# EAGLE design Driver Board (EAGLE 9.6.2)
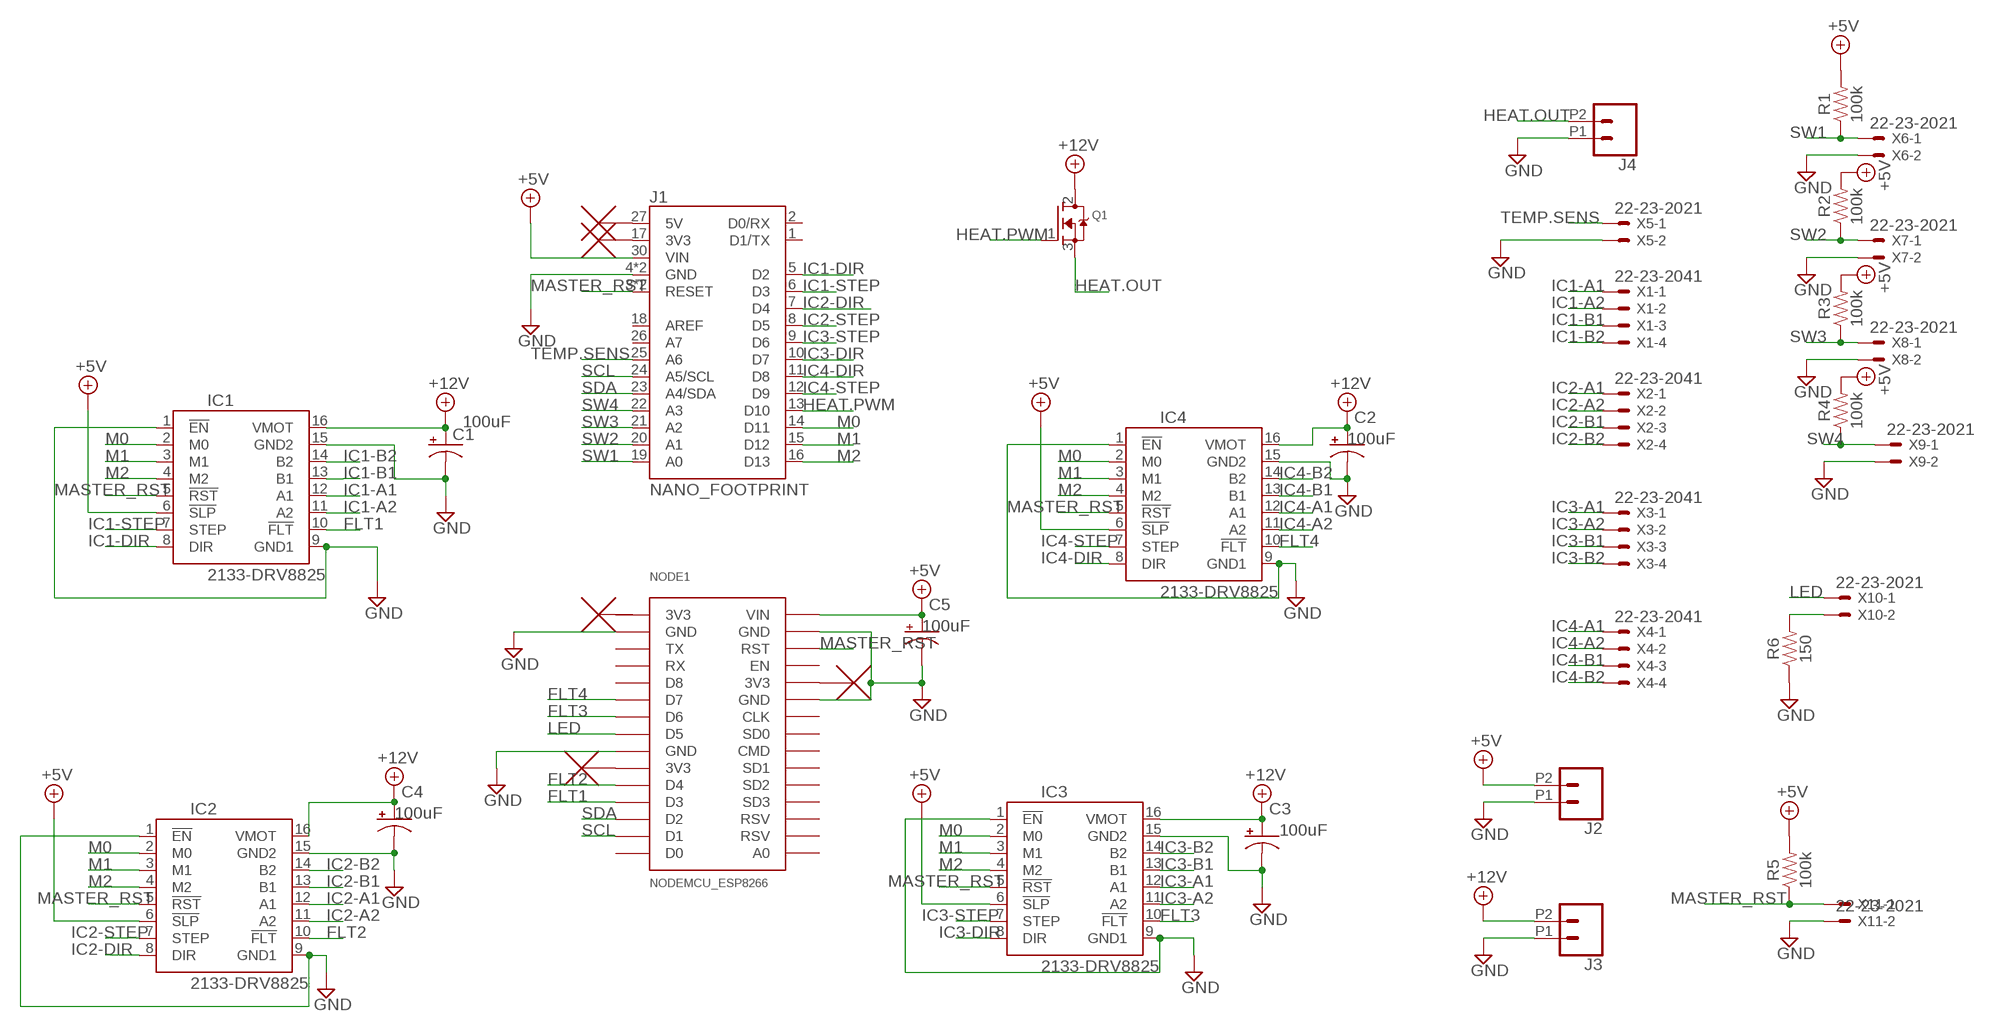
[diagram p0: schematic, sheet 1]

## Parts
C1  CPOL-USD  [PANASONIC_D]
C2  CPOL-USD  [PANASONIC_D]
C3  CPOL-USD  [PANASONIC_D]
C4  CPOL-USD  [PANASONIC_D]
C5  CPOL-USD  [PANASONIC_D]
IC1  2133-DRV8825  [DRV8825]
IC2  2133-DRV8825  [DRV8825]
IC3  2133-DRV8825  [DRV8825]
IC4  2133-DRV8825  [DRV8825]
J1  NANO_FOOTPRINT  [NANO]
J2  CONN_02SCREWTERMINAL-6.35MM-2  [1X02_6.35_SCREWTERM]
J3  CONN_02SCREWTERMINAL-6.35MM-2  [1X02_6.35_SCREWTERM]
J4  CONN_02SCREWTERMINAL-6.35MM-2  [1X02_6.35_SCREWTERM]
NODE1  NODEMCU_ESP8266  [NODEMCU_ESP8266]
Q1  MOSFET-NGDS_TO220V  [TO220V]
R1  100k  0.22OHM-0805-1/4W-1%  [0805]
R2  100k  0.22OHM-0805-1/4W-1%  [0805]
R3  100k  0.22OHM-0805-1/4W-1%  [0805]
R4  100k  0.22OHM-0805-1/4W-1%  [0805]
R5  100k  0.22OHM-0805-1/4W-1%  [0805]
R6  150  0.22OHM-0805-1/4W-1%  [0805]
U$1  NC_MARKER  (no package)
U$2  NC_MARKER  (no package)
U$3  NC_MARKER  (no package)
U$4  NC_MARKER  (no package)
U$5  NC_MARKER  (no package)
X1  22-23-2041  [22-23-2041]
X2  22-23-2041  [22-23-2041]
X3  22-23-2041  [22-23-2041]
X4  22-23-2041  [22-23-2041]
X5  22-23-2021  [22-23-2021]
X6  22-23-2021  [22-23-2021]
X7  22-23-2021  [22-23-2021]
X8  22-23-2021  [22-23-2021]
X9  22-23-2021  [22-23-2021]
X10  22-23-2021  [22-23-2021]
X11  22-23-2021  [22-23-2021]

## Nets
+5V: C5.+ IC1.6(!SLP) IC2.6(!SLP) IC3.6(!SLP) IC4.6(!SLP) J1.30(VIN) J2.P2 NODE1.VIN R1.2 R2.2 R3.2 R4.2 R5.2
+12V: C1.+ C2.+ C3.+ C4.+ IC1.16(VMOT) IC2.16(VMOT) IC3.16(VMOT) IC4.16(VMOT) J3.P2 Q1.2(D)
FLT1: IC1.10(!FLT) NODE1.D3
FLT2: IC2.10(!FLT) NODE1.D4
FLT3: IC3.10(!FLT) NODE1.D6
FLT4: IC4.10(!FLT) NODE1.D7
GND: C1.- C2.- C3.- C4.- C5.- IC1.1(!EN) IC1.9(GND1) IC1.15(GND2) IC2.1(!EN) IC2.9(GND1) IC2.15(GND2) IC3.1(!EN) IC3.9(GND1) IC3.15(GND2) IC4.1(!EN) IC4.9(GND1) IC4.15(GND2) J1.4(GND) J1.29(GND) J2.P1 J3.P1 J4.P1 NODE1.GND@1(GND) NODE1.GND@2(GND) NODE1.GND@3(GND) NODE1.GND@4(GND) R6.1 X5.2 X6.2 X7.2 X8.2 X9.2 X11.2
HEAT.OUT: J4.P2 Q1.3(S)
HEAT.PWM: J1.13(D10) Q1.1(G)
IC1-A1: IC1.12(A1) X1.1
IC1-A2: IC1.11(A2) X1.2
IC1-B1: IC1.13(B1) X1.3
IC1-B2: IC1.14(B2) X1.4
IC1-DIR: IC1.8(DIR) J1.5(D2)
IC1-STEP: IC1.7(STEP) J1.6(D3)
IC2-A1: IC2.12(A1) X2.1
IC2-A2: IC2.11(A2) X2.2
IC2-B1: IC2.13(B1) X2.3
IC2-B2: IC2.14(B2) X2.4
IC2-DIR: IC2.8(DIR) J1.7(D4)
IC2-STEP: IC2.7(STEP) J1.8(D5)
IC3-A1: IC3.12(A1) X3.1
IC3-A2: IC3.11(A2) X3.2
IC3-B1: IC3.13(B1) X3.3
IC3-B2: IC3.14(B2) X3.4
IC3-DIR: IC3.8(DIR) J1.10(D7)
IC3-STEP: IC3.7(STEP) J1.9(D6)
IC4-A1: IC4.12(A1) X4.1
IC4-A2: IC4.11(A2) X4.2
IC4-B1: IC4.13(B1) X4.3
IC4-B2: IC4.14(B2) X4.4
IC4-DIR: IC4.8(DIR) J1.11(D8)
IC4-STEP: IC4.7(STEP) J1.12(D9)
LED: NODE1.D5 X10.1
M0: IC1.2(M0) IC2.2(M0) IC3.2(M0) IC4.2(M0) J1.14(D11)
M1: IC1.3(M1) IC2.3(M1) IC3.3(M1) IC4.3(M1) J1.15(D12)
M2: IC1.4(M2) IC2.4(M2) IC3.4(M2) IC4.4(M2) J1.16(D13)
MASTER_RST: IC1.5(!RST) IC2.5(!RST) IC3.5(!RST) IC4.5(!RST) J1.3(RESET) J1.28(RESET) NODE1.RST R5.1 X11.1
N$1: NODE1.3V3@2(3V3) U$2.P$1
N$2: NODE1.3V3@3(3V3) U$3.P$1
N$3: J1.27(5V) U$4.P$1
N$4: J1.17(3V3) U$5.P$1
N$9: R6.2 X10.2
SCL: J1.24(A5/SCL) NODE1.D1
SDA: J1.23(A4/SDA) NODE1.D2
SW1: J1.19(A0) R1.1 X6.1
SW2: J1.20(A1) R2.1 X7.1
SW3: J1.21(A2) R3.1 X8.1
SW4: J1.22(A3) R4.1 X9.1
TEMP.SENS: J1.25(A6) X5.1
Unconnected: J1.1(D1/TX) J1.2(D0/RX) J1.18(AREF) J1.26(A7) NODE1.A0 NODE1.CLK NODE1.CMD NODE1.D0 NODE1.D8 NODE1.EN NODE1.RSV1(RSV) NODE1.RSV2(RSV) NODE1.RX NODE1.SD1 NODE1.SD2 NODE1.SD3 NODE1.SDO(SD0) NODE1.TX U$1.P$1

## Power pins joined to a net without a drawn wire
3V3: NODE1.3V3@1(3V3)

## Library data of the parts
C1-C5 = adafruit:CPOL-US: POLARIZED CAPACITOR, American symbol; C: 100uF
IC1-IC4 = pololu-stepper-driver:2133-DRV8825: DRV8825 Stepper Motor Driver Carrier, High Current #2133 DRV8825 Stepper Motor Driver Carrier; High Current <https://www.pololu.com/product/2133> in Japan, Suzaku Lab. Ltd. <https://suzakugiken.jp/> #2133 DRV8825 大電流用ステッピングモータドライバ <https://szc.jp/po2133>
J1 = SparkFun-Boards:NANO_FOOTPRINT: Generic Nano Footprint
J2-J4 = SparkFun-Connectors:CONN_02: Multi connection point. Often used as Generic Header-pin footprint for 0.1 inch spaced/style header connections On any of the 0.1 inch spaced packages, you can populate with these: Break Away Headers - Straight <https://www.sparkfun.com/products/116> (PRT-00116) Break Away Male Headers - Right Angle <https://www.sparkfun.com/products/553> (PRT-00553) Female Headers <https://www.sparkfun.com/products/115> (PRT-00115) Break Away Headers - Machine Pin <https://www.sparkfun.com/products/117> (PRT-00117) Break Away Female Headers - Swiss Machine Pin <https://www.sparkfun.com/products/743> (PRT-00743) For SCREWTERMINALS and SPRING TERMINALS visit here: Screw Terimnals on SparkFun.com <https://www.sparkfun.com/search/results?term=Screw+Terminals> (5mm/3.5mm/2.54mm spacing) This device is also useful as a general connection point to wire up your design to another part of your project. Our various solder wires solder well into these plated through hole pads. Hook-Up Wire - Assortment (Stranded, 22 AWG) <https://www.sparkfun.com/products/11375> (PRT-11375) Hook-Up Wire - Assortment (Solid Core, 22 AWG) <https://www.sparkfun.com/products/11367> (PRT-11367) View the entire wire category on our website here <https://www.sparkfun.com/categories/141> Special notes: Molex polarized connector foot print use with: PRT-08233 with associated crimp pins and housings. 2.54_SCREWTERM for use with PRT-10571. 3.5mm Screw Terminal footprints for PRT-08084 5mm Screw Terminal footprints for use with PRT-08432; PROD_ID: CONN-15154
NODE1 = nodemcu_esp8266:NODEMCU_ESP8266: Node MCU V2 (ESP8266) Created by Harish
Q1 = adafruit:MOSFET-N: N-Channel Mosfet 2N7002E - 60V 260mA SOT23 [Digikey: 2N7002ET1GOSTR-ND] - REEL BSH103 - 30V 850mA SOT23 [Digikey: 568-5013-1-ND]
R1-R6 = SparkFun-Resistors:0.22OHM: 0.22Ω resistor A resistor is a passive two-terminal electrical component that implements electrical resistance as a circuit element. Resistors act to reduce current flow, and, at the same time, act to lower voltage levels within circuits. - Wikipedia; PROD_ID: RES-09883; VALUE: 0.22
U$1-U$5 = NC_MARKER:NC_MARKER
X1-X4 = con-molex:22-23-2041: .100" (2.54mm) Center Header - 4 Pin; MF: MOLEX; MPN: 22-23-2041; OC_FARNELL: 1462920; OC_NEWARK: 38C0355
X5-X11 = con-molex:22-23-2021: .100" (2.54mm) Center Header - 2 Pin; MF: MOLEX; MPN: 22-23-2021; OC_FARNELL: 1462926; OC_NEWARK: 25C3832

## Board
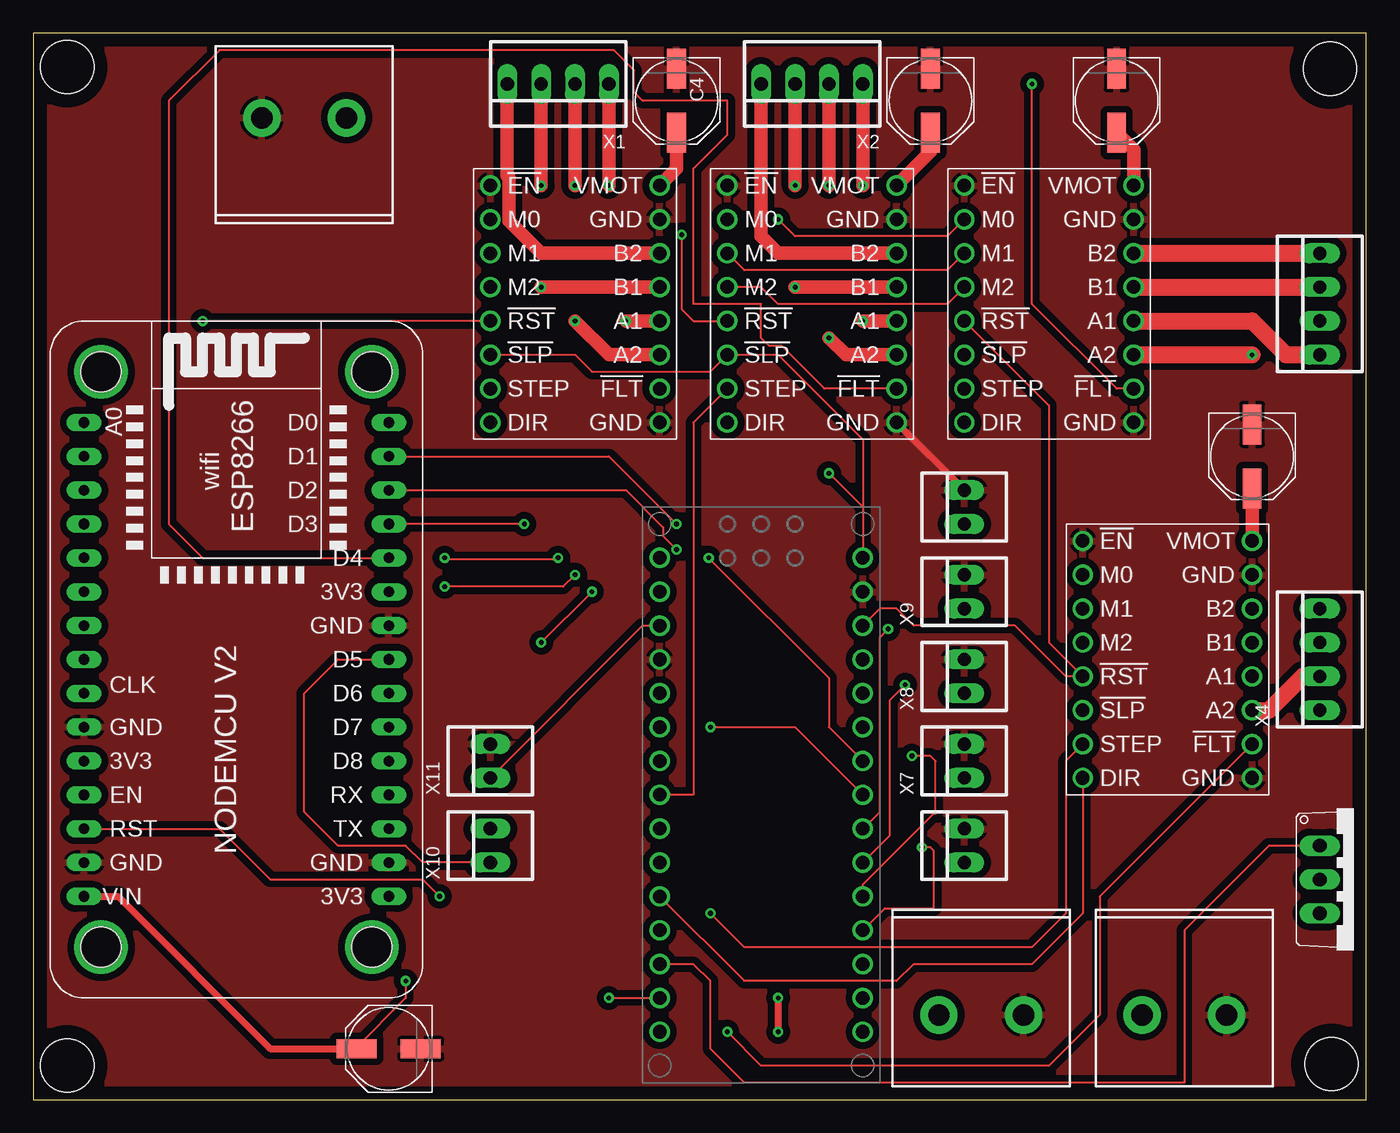
[diagram p1: board, top side]
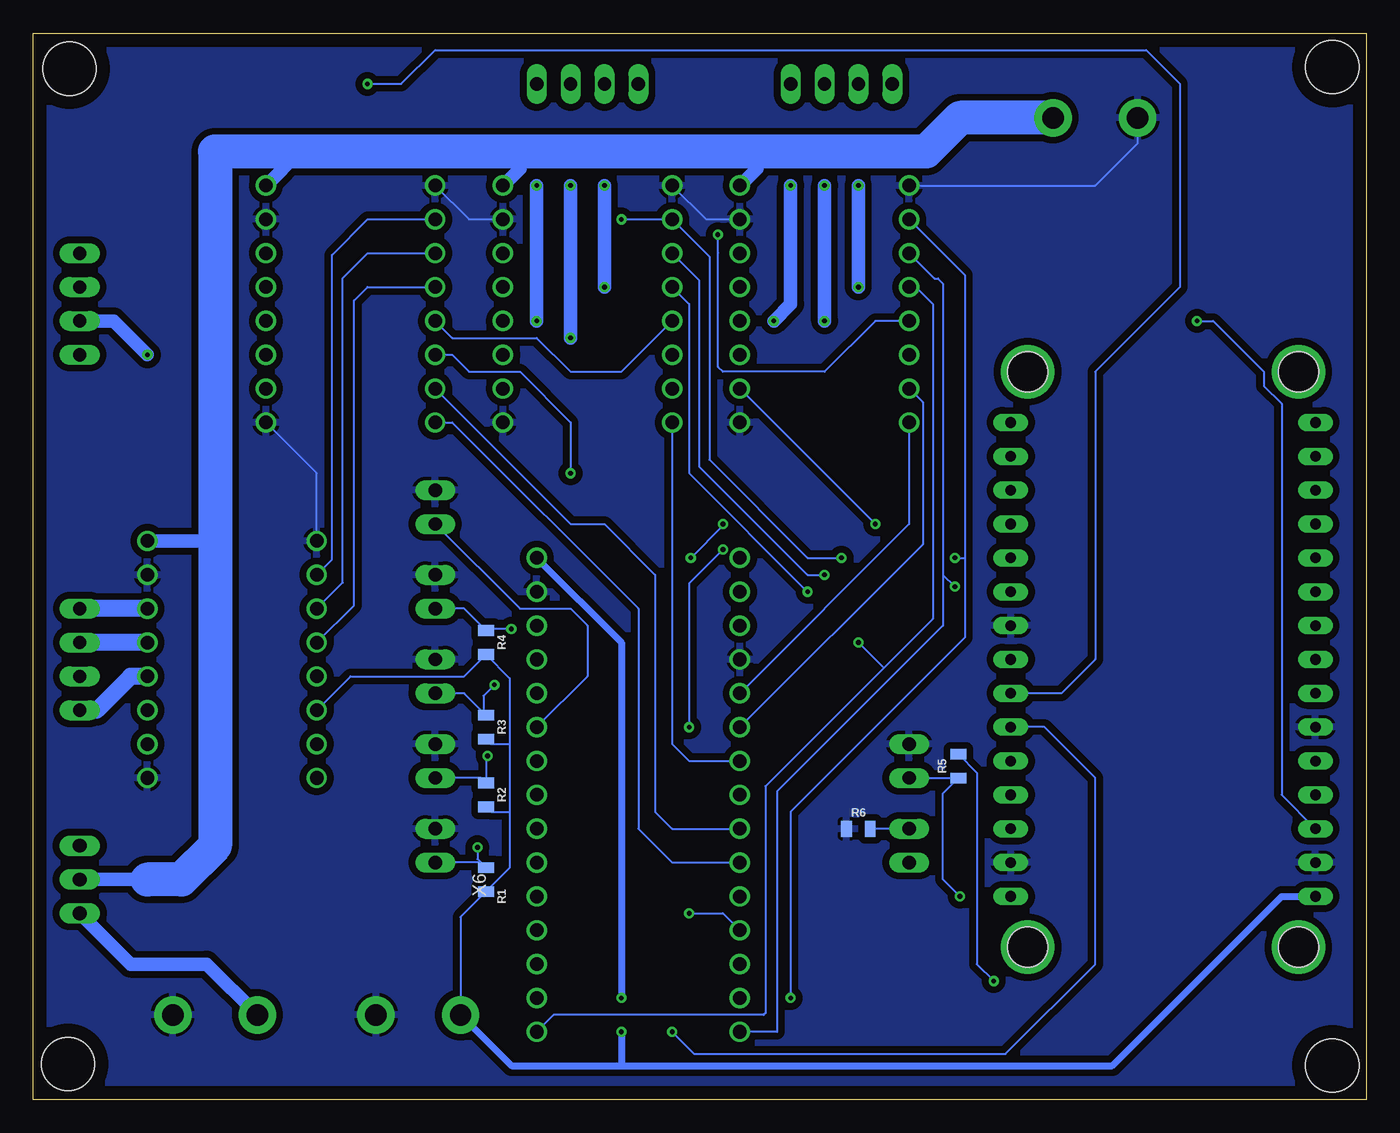
[diagram p2: board, bottom side, seen from below]

Size 100 x 80 mm. Coordinates in mm from the lower left corner, seen from the top.
Outline: 0,0 100,0 100,80 0,80 0,0
Copper layers (1*16): Top 0.035mm / dielectric 1.5mm / Bottom 0.035mm
Design rules "default *": minimum track width 6mil, minimum drill 0.35mm, track to track 20mil, track to pad 6mil, pad to pad 6mil, via to via 6mil, smd to smd 6mil, copper to edge 40mil, drill to drill 6mil, minimum pad ring 10mil, minimum via ring 8mil, stop-mask expansion 4mil, vias tented up to drill 0mil, thermal gap 10mil
Holes 4 mm at 2.54,77.47 97.28,77.34 2.54,2.54 97.41,2.67

### Footprints (pad centres in the part's own frame; a part is rotated, then mirrored left to right if it is on the bottom)
PANASONIC_D = smd 3 x 1.4: + 2.4,0; - -2.4,0
DRV8825 = drill 1.016: 1 -6.35,8.89; 2 -6.35,6.35; 3 -6.35,3.81; 4 -6.35,1.27; 5 -6.35,-1.27; 6 -6.35,-3.81; 7 -6.35,-6.35; 8 -6.35,-8.89; 9 6.35,-8.89; 10 6.35,-6.35; 11 6.35,-3.81; 12 6.35,-1.27; 13 6.35,1.27; 14 6.35,3.81; 15 6.35,6.35; 16 6.35,8.89
NANO = drill 1.016: 1 -7.62,17.78; 2 -7.62,15.24; 3 -7.62,12.7; 4 -7.62,10.16; 5 -7.62,7.62; 6 -7.62,5.08; 7 -7.62,2.54; 8 -7.62,0; 9 -7.62,-2.54; 10 -7.62,-5.08; 11 -7.62,-7.62; 12 -7.62,-10.16; 13 -7.62,-12.7; 14 -7.62,-15.24; 15 -7.62,-17.78; 16 7.62,-17.78; 17 7.62,-15.24; 18 7.62,-12.7; 19 7.62,-10.16; 20 7.62,-7.62; 21 7.62,-5.08; 22 7.62,-2.54; 23 7.62,0; 24 7.62,2.54; 25 7.62,5.08; 26 7.62,7.62; 27 7.62,10.16; 28 7.62,12.7; 29 7.62,15.24; 30 7.62,17.78
1X02_6.35_SCREWTERM = drill 1.6 pad 2.8: P1 -3.175,0; P2 3.175,0
NODEMCU_ESP8266 = drill 0.8 long: 3V3@1 -11.43,19.05; 3V3@2 -11.43,-3.81; 3V3@3 11.43,8.89; A0 11.43,-16.51; CLK 11.43,3.81; CMD 11.43,-1.27; D0 -11.43,-16.51; D1 -11.43,-13.97; D2 -11.43,-11.43; D3 -11.43,-8.89; D4 -11.43,-6.35; D5 -11.43,1.27; D6 -11.43,3.81; D7 -11.43,6.35; D8 -11.43,8.89; EN 11.43,11.43; GND@1 -11.43,16.51; GND@2 -11.43,-1.27; GND@3 11.43,6.35; GND@4 11.43,16.51; RST 11.43,13.97; RSV1 11.43,-11.43; RSV2 11.43,-13.97; RX -11.43,11.43; SD1 11.43,-3.81; SD2 11.43,-6.35; SD3 11.43,-8.89; SDO 11.43,1.27; TX -11.43,13.97; VIN 11.43,19.05 | drill 3: P$31 10.16,22.86; P$32 -10.16,22.86; P$33 -10.16,-20.32; P$34 10.16,-20.32 | hole 3: 10.16,22.86; 10.16,-20.32; -10.16,-20.32; -10.16,22.86
TO220V = drill 1.016 long: 1 -2.54,-2.54; 2 0,-2.54; 3 2.54,-2.54
0805 = smd 0.8 x 1.2: 1 -0.9,0; 2 0.9,0
22-23-2041 = drill 1 long: 1 -3.81,0; 2 -1.27,0; 3 1.27,0; 4 3.81,0
22-23-2021 = drill 1 long: 1 -1.27,0; 2 1.27,0

### Placement (x,y rotation side)
C1  91.44,48.26 270 top
C2  81.28,74.93 270 top
C3  67.31,74.93 270 top
C4  48.26,74.93 270 top
C5  26.67,3.81 180 top
IC1  40.64,59.69 0 top
IC2  58.42,59.69 0 top
IC3  76.2,59.69 0 top
IC4  85.09,33.02 0 top
J1  54.61,22.86 0 top
J2  71.12,6.35 180 top
J3  20.32,73.66 0 top
J4  86.36,6.35 180 top
NODE1  15.24,34.29 180 top
Q1  99.06,16.51 270 top
R1  66.04,16.51 270 bottom
R2  66.04,22.86 270 bottom
R3  66.04,27.94 270 bottom
R4  66.04,34.29 270 bottom
R5  30.61,25.02 90 bottom
R6  38.1,20.32 0 bottom
X1  39.37,76.2 180 top
X2  58.42,76.2 180 top
X3  96.52,59.69 90 top
X4  96.52,33.02 90 top
X5  69.85,44.45 90 top
X6  69.85,19.05 90 top
X7  69.85,25.4 90 top
X8  69.85,31.75 90 top
X9  69.85,38.1 90 top
X10  34.29,19.05 90 top
X11  34.29,25.4 90 top

### Tracks (layer width: path | path; a pad name or v marks a point on that pad's centre or on a via)
+5V  (via drill 0.35)
  Top 0.152: 62.23,44.45 62.23,49.53 55.88,55.88 IC2.6 50.8,54.61 41.91,54.61 40.64,55.88 IC1.6 | v27.94,8.89 27.94,7.62 24.13,3.81 | v59.69,46.99 62.23,44.45 | 62.23,44.45 J1.30
  Top 0.508: NODE1.VIN 6.35,15.24 17.78,3.81 24.13,3.81 C5.+ | v55.88,7.62 v55.88,5.08
  Bottom 0.152: 64.26,26.67 64.26,31.61 R4.2 67.68,31.75 76.2,31.75 IC4.6 | 64.26,26.67 64.26,21.59 | 64.26,21.59 64.26,17.39 R1.2 67.94,13.71 J2.P2 | R2.2 65.67,21.59 64.26,21.59 | R3.2 65.67,26.67 64.26,26.67 | R5.2 29.21,24.52 29.21,10.16 v27.94,8.89 | IC3.6 68.58,55.88 67.31,54.61 63.5,54.61 59.69,50.8 v59.69,46.99
  Bottom 0.508: J2.P2 64.14,2.54 55.88,2.54 | NODE1.VIN 6.35,15.24 19.05,2.54 55.88,2.54 | J1.30 55.88,34.29 v55.88,7.62 | v55.88,5.08 55.88,2.54
+12V
  Top 1.016: C2.+ 82.55,71.26 IC3.16 | C4.+ 48.26,69.85 IC1.16 | C3.+ 67.31,71.12 IC2.16 | C1.+ IC4.16
  Bottom 1.016: 77.47,71.12 80.01,71.12 IC3.16 | IC1.16 45.72,69.85 45.72,71.12 | IC2.16 63.5,69.85 63.5,71.12 | 91.44,16.51 Q1.2 | IC4.16 86.36,41.91
  Bottom 2.54: J3.P2 30.48,73.66 33.02,71.12 45.72,71.12 63.5,71.12 77.47,71.12 86.36,71.12 86.36,41.91 86.36,19.05 88.9,16.51 91.44,16.51
FLT1  (via drill 0.35)
  Top 0.152: v36.83,43.18 NODE1.D3
  Bottom 0.152: IC1.10 v36.83,43.18
FLT2
  Top 0.152: IC2.10 59.35,53.34 56.15,56.54 55.22,56.54 54.61,57.15 54.61,59.69 49.53,59.69 49.53,69.85 52.07,72.39 52.07,74.93 45.72,74.93 45.09,75.56 45.09,77.22 43.56,78.74 13.97,78.74 10.16,74.93 10.16,43.18 12.7,40.64 NODE1.D4
FLT3  (via drill 0.35)
  Top 0.152: IC3.10 81.28,53.34 74.93,59.69 v74.93,76.2
  Bottom 0.152: v74.93,76.2 72.39,76.2 69.85,78.74 16.51,78.74 13.97,76.2 13.97,60.96 20.32,54.61 20.32,33.02 22.86,30.48 NODE1.D6
FLT4  (via drill 0.35)
  Top 0.152: IC4.10 80.01,15.24 80.01,6.35 76.2,2.54 54.61,2.54 v52.07,5.08
  Bottom 0.152: v52.07,5.08 50.42,3.43 27.05,3.43 20.32,10.16 20.32,24.13 24.13,27.94 NODE1.D7
GND
  Top 0.508: IC2.9 X5.2
  Bottom 0.152: IC4.1 78.74,46.99 IC3.9 | IC3.1 67.31,66.04 IC2.15 | IC2.1 49.53,66.04 IC1.15 | IC1.1 20.32,68.58 17.14,71.75 J3.P1
  pour Top (isolate 0.406): 0,0 100.33,0 100.33,80.01 0,80.01
  pour Bottom (isolate 0.406): 0,0 100.33,0 100.33,80.01 0,80.01
HEAT.OUT
  Bottom 1.016: Q1.3 92.71,10.16 87,10.16 J4.P2
HEAT.PWM
  Top 0.152: Q1.1 92.71,19.05 86.36,12.7 86.36,1.27 53.34,1.27 50.8,3.81 50.8,8.89 49.53,10.16 J1.13
IC1-A1  (via drill 0.35)
  Top 1.016: IC1.12 v44.45,58.42 | v43.18,68.58 X1.1
  Bottom 1.016: v44.45,58.42 43.18,59.69 v43.18,68.58
IC1-A2  (via drill 0.35)
  Top 1.016: IC1.11 43.18,55.88 v40.64,58.42 | v40.64,68.58 X1.2
  Bottom 1.016: v40.64,58.42 v40.64,68.58
IC1-B1  (via drill 0.35)
  Top 1.016: IC1.13 v38.1,60.96 | v38.1,68.58 X1.3
  Bottom 1.016: v38.1,60.96 v38.1,68.58
IC1-B2
  Top 1.016: IC1.14 38.1,63.5 35.71,65.89 35.71,69.17 35.56,69.32 X1.4
IC1-DIR
  Bottom 0.152: IC1.8 34.29,43.18 J1.5
IC1-STEP
  Bottom 0.152: IC1.7 33.27,52.32 33.27,41.66 J1.6
IC2-A1  (via drill 0.35)
  Top 1.016: IC2.12 v62.23,58.42 | v62.23,68.58 X2.1
  Bottom 1.016: v62.23,58.42 v62.23,68.58
IC2-A2  (via drill 0.35)
  Top 1.016: IC2.11 60.96,55.88 v59.69,57.15 | X2.2 v59.69,68.58
  Bottom 1.016: v59.69,57.15 v59.69,68.58
IC2-B1  (via drill 0.35)
  Top 1.016: IC2.13 v57.15,60.96 | v57.15,68.58 X2.3
  Bottom 1.016: v57.15,60.96 v57.15,68.58
IC2-B2
  Top 1.016: IC2.14 55.88,63.5 54.61,64.77 X2.4
IC2-DIR
  Bottom 0.152: IC2.8 52.07,26.67 50.8,25.4 J1.7
IC2-STEP
  Top 0.152: IC2.7 49.53,50.8 49.53,22.86 J1.8
IC3-A1
  Top 1.27: IC3.12 91.44,58.42 93.98,55.88 X3.1
IC3-A2  (via drill 0.35)
  Top 1.27: IC3.11 v91.44,55.88
  Bottom 1.016: v91.44,55.88 93.98,58.42 X3.2
IC3-B1
  Top 1.27: IC3.13 X3.3
IC3-B2
  Top 1.27: IC3.14 X3.4
IC3-DIR
  Bottom 0.152: IC3.8 68.58,50.8 54.61,36.83 54.61,20.32 52.07,17.78 J1.10
IC3-STEP
  Bottom 0.152: IC3.7 59.69,43.18 57.15,43.18 53.34,39.37 53.34,21.59 52.07,20.32 J1.9
IC4-A1
  Bottom 1.27: IC4.12 92.71,31.75 95.25,29.21 X4.1
IC4-A2
  Top 1.27: IC4.11 92.71,29.21 95.25,31.75 X4.2
IC4-B1
  Bottom 1.27: IC4.13 X4.3
IC4-B2
  Bottom 1.27: IC4.14 X4.4
IC4-DIR
  Top 0.152: IC4.8 78.74,13.97 74.93,10.16 66.04,10.16 64.77,8.89 53.34,8.89 J1.11
IC4-STEP  (via drill 0.35)
  Top 0.152: IC4.7 77.47,25.4 77.47,13.97 74.93,11.43 53.34,11.43 v50.8,13.97
  Bottom 0.152: v50.8,13.97 48.26,13.97 J1.12
LED
  Top 0.152: X10.1 29.21,17.78 27.94,19.05 22.86,19.05 20.32,21.59 20.32,30.48 22.86,33.02 NODE1.D5
M0  (via drill 0.35)
  Top 0.152: v43.18,7.62 J1.14 | v39.37,40.64 39.24,40.51 30.86,40.51 v30.86,40.64 | IC3.2 68.58,64.77 57.15,64.77 v55.88,66.04
  Bottom 0.152: IC1.2 30.1,61.85 30.1,40.64 | 30.1,40.64 30.1,34.67 43.18,21.59 v43.18,7.62 | v39.37,40.64 41.91,40.64 49.28,48.01 49.28,63.25 IC2.2 v55.88,66.04 | v30.86,40.64 30.1,40.64 | IC4.2 77.6,40.51 77.6,63.37 74.93,66.04 IC3.2
M1  (via drill 0.35)
  Top 0.152: v40.64,39.37 39.75,38.48 v30.86,38.48 | IC3.3 68.58,62.23 53.34,62.23 IC2.3
  Bottom 0.152: IC1.3 32.38,61.59 32.13,61.59 31.75,61.21 31.75,39.37 | J1.15 44.2,5.08 44.2,23.11 31.75,35.56 31.75,39.37 | v40.64,39.37 41.91,39.37 50.04,47.5 50.04,61.47 IC2.3 | v30.86,38.48 31.75,39.37 | IC4.3 76.78,38.79 76.78,61.65 74.93,63.5 IC3.3
M2  (via drill 0.35)
  Top 0.152: v41.91,38.1 v38.1,34.29 | IC3.4 68.58,59.69 55.88,59.69 54.61,60.96 IC2.4
  Bottom 0.152: IC1.4 33.78,60.96 32.51,59.69 32.51,36.07 36.2,32.38 | J1.16 60.96,6.35 45.21,6.35 45.09,6.48 45.09,23.5 36.2,32.38 | IC2.4 50.8,59.69 50.8,46.99 v41.91,38.1 | v38.1,34.29 36.2,32.38 | IC4.4 75.95,37.08 75.95,59.94 74.93,60.96 IC3.4
MASTER_RST  (via drill 0.35)
  Top 0.152: IC1.5 v12.7,58.42 | X11.1 45.72,35.56 J1.3 | NODE1.RST 13.97,20.32 17.78,16.51 29.21,16.51 v30.48,15.24 | J1.28 63.5,36.83 64.77,36.83 66.04,35.56 73.66,35.56 77.47,31.75 IC4.5 76.2,34.29 76.2,52.07 IC3.5 | v48.64,64.9 48.64,59.31 49.53,58.42 IC2.5
  Bottom 0.152: v12.7,58.42 11.48,58.42 7.67,54.61 7.67,53.54 6.35,52.21 6.35,22.86 NODE1.RST | X11.1 R5.1 31.75,22.98 31.75,16.51 v30.48,15.24 | IC3.5 68.58,57.15 62.23,57.15 59.69,54.61 55.88,54.61 IC2.5 | IC1.5 36.83,58.42 40.64,54.61 48.26,54.61 48.62,54.97 48.62,63.52 48.64,63.55 v48.64,64.9
N$9
  Bottom 0.152: X10.2 R6.2
SCL  (via drill 0.35)
  Top 0.152: NODE1.D1 43.18,48.26 v48.26,43.18 | v50.67,40.64 59.69,31.62 59.69,27.94 J1.24
  Bottom 0.152: v48.26,43.18 48.26,43.05 v50.67,40.64
SDA  (via drill 0.35)
  Top 0.152: NODE1.D2 44.45,45.72 47.24,42.93 47.24,42.29 v48.26,41.27 | v50.8,27.94 57.15,27.94 J1.23
  Bottom 0.152: v48.26,41.27 50.8,38.73 v50.8,27.94
SW1  (via drill 0.35)
  Top 0.152: J1.19 63.88,14.35 67.56,14.35 67.56,18.67 67.31,18.92 v66.67,18.92
  Bottom 0.152: R1.1 66.22,17.59 66.41,17.78 | 66.41,17.78 X6.1 | v66.67,18.92 66.67,18.05 66.41,17.78
SW2  (via drill 0.35)
  Top 0.152: J1.20 62.23,16.13 67.56,21.46 67.69,21.46 67.69,25.4 67.31,25.78 v65.91,25.78
  Bottom 0.152: X7.1 66.41,24.13 R2.1 66.04,25.65 v65.91,25.78
SW3  (via drill 0.35)
  Top 0.152: J1.21 64.26,19.81 64.26,29.97 v65.41,31.11
  Bottom 0.152: R3.1 66.22,29.02 | 66.22,29.02 67.68,30.48 X8.1 | v65.41,31.11 66.22,30.3 66.22,29.02
SW4  (via drill 0.35)
  Top 0.152: J1.22 63.5,21.59 63.5,34.67 v64.14,35.31
  Bottom 0.152: X9.1 67.68,36.83 R4.1 65.92,35.31 v64.14,35.31
TEMP.SENS
  Bottom 0.152: J1.25 58.42,31.75 58.42,35.56 59.69,36.83 63.5,36.83 X5.1